# Altium schematic sheet S7CAS-PLEIADES-CARTE-MERE_P20_Connecteurs-bank-0.SchDoc
size Tabloid; Sheet_Name: Insert name in Document Parameters; Size: 11x17
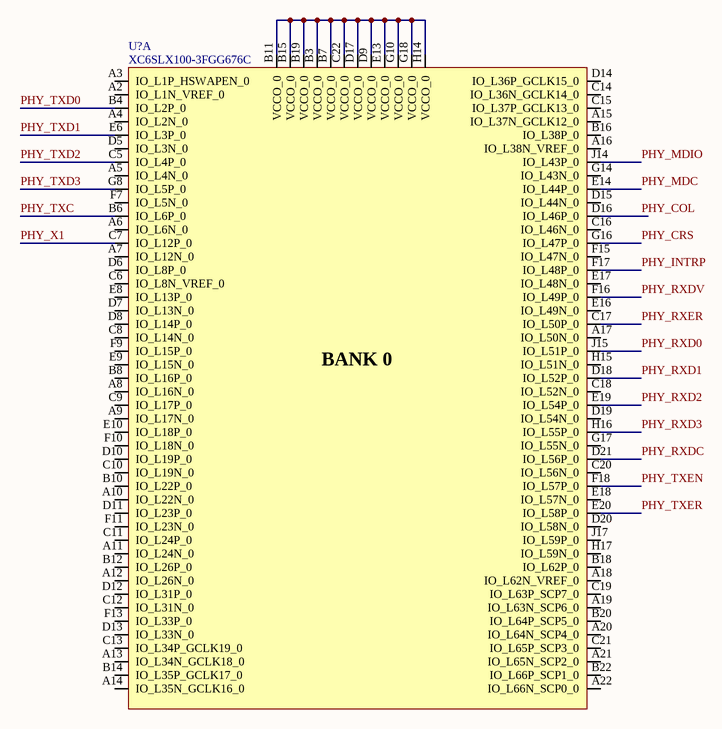
[diagram p0: S7CAS-PLEIADES-CARTE-MERE_P20_Connecteurs-bank-0.SchDoc]

## Parts
U?  XC6SLX100-3FGG676C  [FPGA_XILINX_FGG676]  (part A of 10)

## Nets
PHY_COL: U?.D16(IO_L46P_0)
PHY_CRS: U?.G16(IO_L47P_0)
PHY_INTRP: U?.F17(IO_L48P_0)
PHY_MDC: U?.E14(IO_L44P_0)
PHY_MDIO: U?.J14(IO_L43P_0)
PHY_RXD0: U?.J15(IO_L51P_0)
PHY_RXD1: U?.D18(IO_L52P_0)
PHY_RXD2: U?.E19(IO_L54P_0)
PHY_RXD3: U?.H16(IO_L55P_0)
PHY_RXDC: U?.D21(IO_L56P_0)
PHY_RXDV: U?.F16(IO_L49P_0)
PHY_RXER: U?.C17(IO_L50P_0)
PHY_TXC: U?.B6(IO_L6P_0)
PHY_TXD0: U?.B4(IO_L2P_0)
PHY_TXD1: U?.E6(IO_L3P_0)
PHY_TXD2: U?.C5(IO_L4P_0)
PHY_TXD3: U?.G8(IO_L5P_0)
PHY_TXEN: U?.F18(IO_L57P_0)
PHY_TXER: U?.E20(IO_L58P_0)
PHY_X1: U?.C7(IO_L12P_0)
NetU?_B3: U?.B3(VCCO_0) U?.B7(VCCO_0) U?.B11(VCCO_0) U?.B15(VCCO_0) U?.B19(VCCO_0) U?.C22(VCCO_0) U?.D9(VCCO_0) U?.D17(VCCO_0) U?.E13(VCCO_0) U?.G10(VCCO_0) U?.G18(VCCO_0) U?.H14(VCCO_0)

Not connected (* = marked no-connect by the designer): U? A2(IO_L1N_VREF_0) A3(IO_L1P_HSWAPEN_0) A4(IO_L2N_0) A5(IO_L4N_0) A6(IO_L6N_0) A7(IO_L12N_0) A8(IO_L16N_0) A9(IO_L17N_0) A10(IO_L22N_0) A11(IO_L24N_0) A12(IO_L26N_0) A13(IO_L34N_GCLK18_0) A14(IO_L35N_GCLK16_0) A15(IO_L37N_GCLK12_0) A16(IO_L38N_VREF_0) A17(IO_L50N_0) A18(IO_L62N_VREF_0) A19(IO_L63N_SCP6_0) A20(IO_L64N_SCP4_0) A21(IO_L65N_SCP2_0) A22(IO_L66N_SCP0_0) B8(IO_L16P_0) B10(IO_L22P_0) B12(IO_L26P_0) B14(IO_L35P_GCLK17_0) B16(IO_L38P_0) B18(IO_L62P_0) B20(IO_L64P_SCP5_0) B22(IO_L66P_SCP1_0) C6(IO_L8N_VREF_0) C8(IO_L14N_0) C9(IO_L17P_0) C10(IO_L19N_0) C11(IO_L24P_0) C12(IO_L31N_0) C13(IO_L34P_GCLK19_0) C14(IO_L36N_GCLK14_0) C15(IO_L37P_GCLK13_0) C16(IO_L46N_0) C18(IO_L52N_0) C19(IO_L63P_SCP7_0) C20(IO_L56N_0) C21(IO_L65P_SCP3_0) D5(IO_L3N_0) D6(IO_L8P_0) D7(IO_L13N_0) D8(IO_L14P_0) D10(IO_L19P_0) D11(IO_L23P_0) D12(IO_L31P_0) D13(IO_L33N_0) D14(IO_L36P_GCLK15_0) D15(IO_L44N_0) D19(IO_L54N_0) D20(IO_L58N_0) E8(IO_L13P_0) E9(IO_L15N_0) E10(IO_L18P_0) E16(IO_L49N_0) E17(IO_L48N_0) E18(IO_L57N_0) F7(IO_L5N_0) F9(IO_L15P_0) F10(IO_L18N_0) F11(IO_L23N_0) F13(IO_L33P_0) F15(IO_L47N_0) G14(IO_L43N_0) G17(IO_L55N_0) H15(IO_L51N_0) H17(IO_L59N_0) J17(IO_L59P_0)

## Notes on the sheet
- Sheet Name
- Project Title
- Global Project
- Size
- Group
- Revision
- Date
- Sheet
- of
- Filename
- Designers
- (in symbol FPGA_XC6SLX100-3FGG676C, part A) BANK 0

## Library data of the parts
U? = FPGA_XC6SLX100-3FGG676C: FPGA - XILINX SPARTAN 6 480 I/O - BGA-676; Voltage: 1.14 V ~ 1.26 V; Current: *; Power: *; Mfg: Xilinx; Mfg Part Number: XC6SLX100-3FGG676C; HelpURL: https://www.xilinx.com/support/documentation/data_sheets/ds162.pdf; CreatedBy: Jonathan Bouchard; Temperature: 0°C ~ 85°C (TJ); Value: *; Precision: *; Package: BGA-676; Supplier 1: Digikey; Supplier Part Number 1: 122-1760-ND